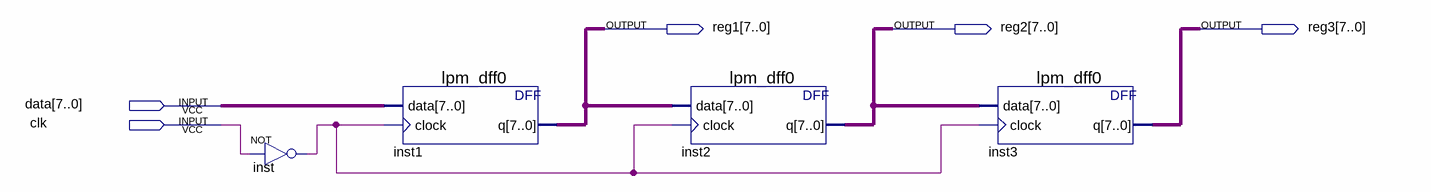
[diagram p0: schematic sheet]
// Quartus schematic Buffer.bdf as structural Verilog: 4 symbols, 5 pins
module Buffer (
  input  [7:0] data,
  input  clk,
  output [7:0] reg1,
  output [7:0] reg2,
  output [7:0] reg3
);

  wire inst_out;

  not inst (inst_out, clk);
  lpm_dff0 inst1 (.data(data), .clock(inst_out), .q(reg1));
  lpm_dff0 inst2 (.data(reg1), .clock(inst_out), .q(reg2));
  lpm_dff0 inst3 (.data(reg2), .clock(inst_out), .q(reg3));
endmodule
